# Altium schematic sheet p2.SchDoc
size A4
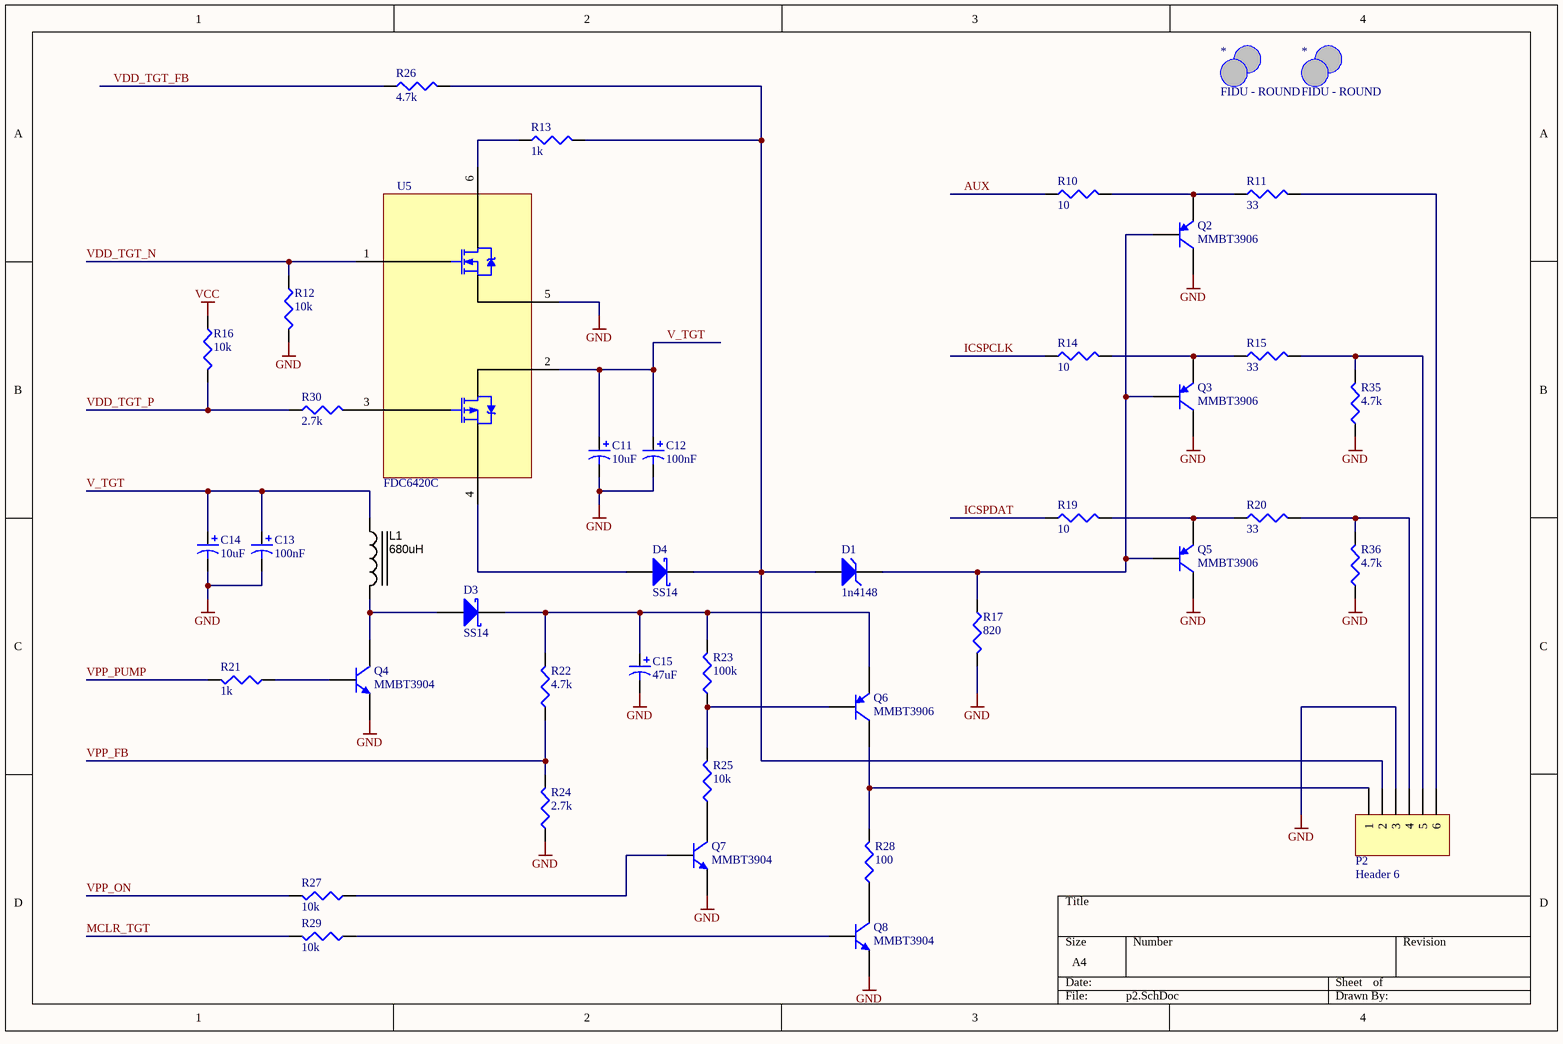
[diagram p0: p2.SchDoc]

## Parts
(Parts that share a designator on the sheet are numbered #1, #2 ... from top to bottom, then left to right.)
*#1  FIDU - ROUND  [FIDU-ROUND]
*#2  FIDU - ROUND  [FIDU-ROUND]
C11  value 10uF  [C0805]  (hidden comment: Cap Pol3)
C12  value 100nF  [C0805]  (hidden comment: Cap Pol3)
C13  value 100nF  [C0805]  (hidden comment: Cap Pol3)
C14  value 10uF  [C0805]  (hidden comment: Cap Pol3)
C15  value 47uF  [C0805]  (hidden comment: Cap Pol3)
D1  1n4148  [SOD-123]
D3  SS14  [SMA]
D4  SS14  [SMA]
L1  680uH  [IND_WW_DR73]
P2  Header 6  [HDR1X6]
Q2  MMBT3906  [SOT23_N]
Q3  MMBT3906  [SOT23_N]
Q4  MMBT3904  [SOT23_N]
Q5  MMBT3906  [SOT23_N]
Q6  MMBT3906  [SOT23_N]
Q7  MMBT3904  [SOT23_N]
Q8  MMBT3904  [SOT23_N]
R10  value 10  [RESC2012X70N]  (hidden comment: Res3)
R11  value 33  [RESC2012X70N]  (hidden comment: Res3)
R12  value 10k  [RESC2012X70N]  (hidden comment: Res3)
R13  value 1k  [RESC2012X70N]  (hidden comment: Res3)
R14  value 10  [RESC2012X70N]  (hidden comment: Res3)
R15  value 33  [RESC2012X70N]  (hidden comment: Res3)
R16  value 10k  [RESC2012X70N]  (hidden comment: Res3)
R17  value 820  [RESC2012X70N]  (hidden comment: Res3)
R19  value 10  [RESC2012X70N]  (hidden comment: Res3)
R20  value 33  [RESC2012X70N]  (hidden comment: Res3)
R21  value 1k  [RESC2012X70N]  (hidden comment: Res3)
R22  value 4.7k  [RESC2012X70N]  (hidden comment: Res3)
R23  value 100k  [RESC2012X70N]  (hidden comment: Res3)
R24  value 2.7k  [RESC2012X70N]  (hidden comment: Res3)
R25  value 10k  [RESC2012X70N]  (hidden comment: Res3)
R26  value 4.7k  [RESC2012X70N]  (hidden comment: Res3)
R27  value 10k  [RESC2012X70N]  (hidden comment: Res3)
R28  value 100  [RESC2012X70N]  (hidden comment: Res3)
R29  value 10k  [RESC2012X70N]  (hidden comment: Res3)
R30  value 2.7k  [RESC2012X70N]  (hidden comment: Res3)
R35  value 4.7k  [RESC2012X70N]  (hidden comment: Res3)
R36  value 4.7k  [RESC2012X70N]  (hidden comment: Res3)
U5  FDC6420C  [SSOT23]

## Nets
GND: C11.2 C12.2 C13.2 C14.2 C15.2 P2.3 Q2.3(C) Q3.3(C) Q4.2(E) Q5.3(C) Q7.2(E) Q8.2(E) R12.2 R17.2 R24.1 R35.1 R36.1 U5.5(NS)
VCC: R16.1
AUX: R10.1
ICSPCLK: R14.1
ICSPDAT: R19.1
MCLR_TGT: R29.2
V_TGT: C11.1 C12.1 C13.1 C14.1 L1.1 U5.2(PD)
VDD_TGT_FB: R26.1
VDD_TGT_N: R12.1 U5.1(NG)
VDD_TGT_P: R16.2 R30.1
VPP_FB: R22.1 R24.2
VPP_ON: R27.2
VPP_PUMP: R21.2
NetC15_1: C15.1 D3.2(K) Q6.2(E) R22.2 R23.2
NetD1_1: D1.1(A) D4.2(K) P2.2 R13.2 R26.2
NetD1_2: D1.2(K) Q2.1(B) Q3.1(B) Q5.1(B) R17.1
NetD3_1: D3.1(A) L1.2 Q4.3(C)
NetD4_1: D4.1(A) U5.4(PS)
NetP2_1: P2.1 Q6.3(C) R28.2
NetP2_4: P2.4 R20.2 R36.2
NetP2_5: P2.5 R15.2 R35.2
NetP2_6: P2.6 R11.2
NetQ2_2: Q2.2(E) R10.2 R11.1
NetQ3_2: Q3.2(E) R14.2 R15.1
NetQ4_1: Q4.1(B) R21.1
NetQ5_2: Q5.2(E) R19.2 R20.1
NetQ6_1: Q6.1(B) R23.1 R25.2
NetQ7_1: Q7.1(B) R27.1
NetQ7_3: Q7.3(C) R25.1
NetQ8_1: Q8.1(B) R29.1
NetQ8_3: Q8.3(C) R28.1
NetR13_1: R13.1 U5.6(ND)
NetR30_2: R30.2 U5.3(PG)

## Library data of the parts
C11-C15 = Cap Pol3: Polarized Capacitor (Surface Mount); Published: 8-Jun-2000; LatestRevisionDate: 29-May-2009; LatestRevisionNote: IPC-7351 Footprint Added.; PackageReference: C0805; Publisher: Altium Limited; PackageDescription: Chip Capacitor
D1 = BZT52C47: Surface Mount Zener Diode; Published: 8-Jun-2000; LatestRevisionDate: 17-Jul-2002; LatestRevisionNote: Re-released for DXP Platform.; DatasheetDocument: REV. L-2; PackageReference: SOD-123; Publisher: Altium Limited; ComponentLink1Description: Manufacturer Link; ComponentLink1URL: http://www.vishay.com/; Supplier Part Number 1: 1N4148W-E3-18CT-ND; Supplier 1: Digi-Key
D3 D4 = 10MQ060N: Schottky Rectifier; Published: 17-Sep-2003; DatasheetVersion: May-2002; PackageVersion: revH, May-2002; PackageReference: SMA; Publisher: Altium Limited; PackageDescription: DO-214-AC/SMA; 2 C-Bend Leads; Body 5 x 2.7 mm, inc. leads (LxW); ComponentLink1Description: Manufacturer Link; ComponentLink1URL: http://www.irf.com/; ComponentLink2Description: Datasheet; ComponentLink2URL: http://www.irf.com/product-info/datasheets/data/10MQ060N.pdf; Supplier Part Number 1: SS14-E3/61TGICT-ND; Supplier 1: Digi-Key
L1 = INDC_10u_DR73-100-R: Inductor Power 10µH 2.1A 7.6x7.6mm SMD; Manufacturer 1: Cooper Bussmann; Tolerance: ±20%; Material: ferrite shielded; SCDType: spec; Package / Case: 5.0x5.0x4.5mm; Ratings: 2.1 A; Supplier 1: Digi-Key; Supplier Part Number 1: 513-1129-1-ND; Manufacturer Part Number 1: DR73-100-R; ComponentLink1URL: http://www.cooperindustries.com/content/dam/public/bussmann/Electronics/Resources/Data%20Sheets/Bus_Elx_DS_4315_DR_Series.pdf; ComponentLink1Description: http://www.cooperindustries.com/content/dam/public/bussmann/Electronics/Resources/Data%20Sheets/Bus_Elx_DS_4315_DR_Series.pdf; Value: 680uH
P2 = Header 6: Header, 6-Pin; LatestRevisionDate: 17-Jul-2002; LatestRevisionNote: Re-released for DXP Platform.; Publisher: Altium Limited; Supplier Part Number 1: S5481-ND
Q2 Q3 Q5 Q6 = MMBT3906: PNP Switching Transistor; Published: 17-Sep-2003; LatestRevisionDate: 12-Dec-2006; LatestRevisionNote: IPC-7351 Footprint Added.; DatasheetVersion: 11-Apr-2000; PackageVersion: May-1999; PackageReference: SOT23; Publisher: Altium Limited; PackageDescription: 3-Pin SOT-23 Package 0.95 mm Pitch, 2.3 mm Lead Span; ComponentLink1Description: Manufacturer Link; ComponentLink1URL: http://www.semiconductors.philips.com/; ComponentLink2Description: Datasheet; ComponentLink2URL: http://www.semiconductors.philips.com/acrobat/datasheets/MMBT3906_2.pdf; Supplier Part Number 1: MMBT3906LT1GOSCT-ND
  Q2 Q3 Q5: Supplier 1: Digi-Key
Q4 Q7 Q8 = MMBT3904: NPN Switching Transistor; Published: 17-Sep-2003; LatestRevisionDate: 12-Dec-2006; LatestRevisionNote: IPC-7351 Footprint Added.; DatasheetVersion: 13-May-2002; PackageVersion: May-1999; PackageReference: SOT23; Publisher: Altium Limited; PackageDescription: 3-Pin SOT-23 Package 0.95 mm Pitch, 2.3 mm Lead Span; ComponentLink1Description: Manufacturer Link; ComponentLink1URL: http://www.semiconductors.philips.com/; ComponentLink2Description: Datasheet; ComponentLink2URL: http://www.semiconductors.philips.com/acrobat/datasheets/MMBT3904_4.pdf; Supplier Part Number 1: MMBT3904FSCT-ND; Supplier 1: Digi-Key
R10-R17 R19-R30 R35 R36 = Res3: Resistor; Published: 8-Jun-2000; LatestRevisionDate: 29-May-2009; LatestRevisionNote: IPC-7351 Footprint Added.; PackageReference: J1-0603; Publisher: Altium Limited; PackageDescription: Chip Resistor
U5 = FDC6420C: Supplier Part Number 1: FDC6420CCT-ND; Supplier 1: Digi-Key